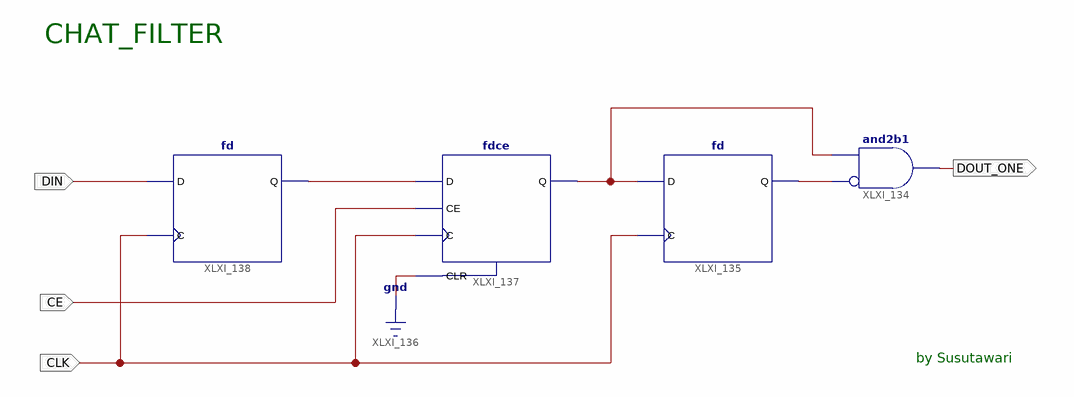
[diagram p0: schematic sheet 1]
// Xilinx ISE schematic CHAT_FILTER.sch (spartan3a) as structural Verilog: 4 symbols, 4 ports
module CHAT_FILTER (
  input  CE,
  input  CLK,
  input  DIN,
  output DOUT_ONE
);

  wire XLXN_439, XLXN_440, XLXN_445;

  and XLXI_134 (DOUT_ONE, ~XLXN_440, XLXN_439);  // and2b1
  fd XLXI_135 (.C(CLK), .D(XLXN_439), .Q(XLXN_440));
  fdce XLXI_137 (.C(CLK), .CE(CE), .CLR(1'b0), .D(XLXN_445), .Q(XLXN_439));
  fd XLXI_138 (.C(CLK), .D(DIN), .Q(XLXN_445));

  // Notes on the sheet:
  //   CHAT_FILTER
  //   by Susutawari
endmodule
